# Altium schematic sheet PreAmplifier.SchDoc
size A
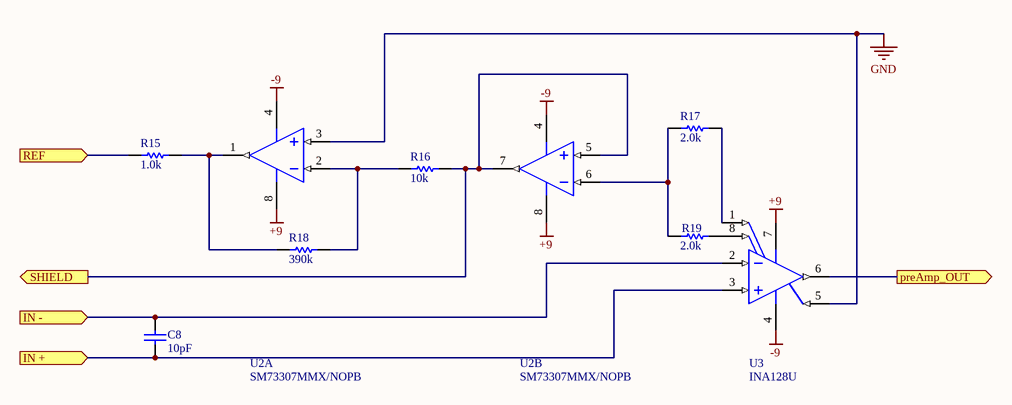
[diagram p0: PreAmplifier.SchDoc]

## Parts
C8  value 10pF  [0402cap]  (hidden comment: C0402)
R15  value 1.0k  [0402RES]  (hidden comment: R0402)
R16  value 10k  [0402RES]  (hidden comment: R0402)
R17  value 2.0k  [0402RES]  (hidden comment: R0402)
R18  value 390k  [0402RES]  (hidden comment: R0402)
R19  value 2.0k  [0402RES]  (hidden comment: R0402)
U2  SM73307MMX/NOPB  [MUA08A_N]  (parts A,B of 2)
U3  INA128U  [TI-D8_N]

## Ports
IN + (in), IN - (in), preAmp_OUT (out), REF (in), SHIELD (out)

## Nets
+9: U2.8(V+) U3.7(V+)
-9: U2.4(V-) U3.4(V-)
GND: U2.3(INA+) U3.5(REF)
IN +: C8.1 U3.3(VIN+) ; port IN +
IN -: C8.2 U3.2(VIN-) ; port IN -
preAmp_OUT: U3.6(VO) ; port preAmp_OUT
REF: R15.1 ; port REF
SHIELD: R16.2 U2.5(INB+) U2.7(OUTB) ; port SHIELD
NetR15_2: R15.2 R18.1 U2.1(OUTA)
NetR16_1: R16.1 R18.2 U2.2(INA-)
NetR17_1: R17.1 R19.1 U2.6(INB-)
NetR17_2: R17.2 U3.1(RG)
NetR19_2: R19.2 U3.8(RG)

## Library data of the parts
C8 = C0402: 0402 Ceramic Chip Capacitor - Standard
R15-R19 = R0402: 0402 Chip Resistor - Standard; ComponentLink1URL: *
U2 = SM73307MMX/NOPB: Dual Precision, 17 MHz, Low Noise, CMOS Input Amplifier, 8-pin Mini SOIC, 3500 Reel; Manufacturer: National Semiconductor; PackageTopMarking: ZXTT*S307; PowerWise: N; CompType: Amplifiers; High-Reliability: Y; DatasheetVersion: Jun-2011; PackageVersion: revF, Apr-2008; PackageReference: MUA08A; PackageDescription: MINI SOIC, .118 x .118 x .034in, 8 Lead, .0256in Pitch; PartNumber: SM73307MMX/NOPB; RoHS: Y; PinCount: 8; Code_JEDEC: MO-187-AA; ComponentLink1Description: Manufacturer URL; ComponentLink1URL: http://www.national.com/; ComponentLink2Description: SM73307 Datasheet; ComponentLink2URL: http://www.national.com/ds/SM/SM73307.pdf; ComponentLink3Description: SM73307 Web Page; ComponentLink3URL: http://www.national.com/pf/SM/SM73307.html; ComponentLink4Description: MUA08A Package Page; ComponentLink4URL: http://www.national.com/packaging/folders/mua08a.html
U3 = INA128U: Precision, Low Power Instrumentation Amplifier, -40 to 85 degC, 8-pin SOIC (D8), Green (RoHS & no Sb/Br); Manufacturer: Texas Instruments; CMRR(Min)(dB): 120; Gain(V/V): 1 to 10000; Input Bias Current (+/-)(Max)(nA): 5; Input Offset (+/-)(Max)(uV): 50; Input Offset Drift (+/-)(Max)(uV/Degrees Celsius): 0.5; Noise at 1kHz(Typ)(nV/rt(Hz)): 8; Non-Linearity (+/-)(Max)(%): 0.002; Number of Channels: 1; Quiescent Current (+/-)(Typ)(mA): 0.7; SubFamily: Dual Supply; Vs(Max)(V): 36; Vs(Min)(V): 4.5; DatasheetVersion: SBOS051B; PackageVersion: 4040047-3/M, 06/2011; PackageReference: D8; PackageDescription: 8-Pin Plastic Small Outline, Body 4.9 x 3.9 mm, Pitch 1.27 mm; Supplier 1: Digi-Key; Supplier Part Number 1: INA128U-ND; Supplier 2: Farnell; Supplier Part Number 2: 1212413; Supplier 3: Newark; Supplier Part Number 3: 35C1729; Supplier 4: Mouser; Supplier Part Number 4: 595-INA128U; Eco-Plan: Green (RoHS & no Sb/Br); Mounting Technology: Surface Mount; Code_JEDEC: MS-012; PartNumber: INA128U; ComponentLink1Description: Manufacturer URL; ComponentLink1URL: http://www.ti.com/; ComponentLink2Description: Datasheet; ComponentLink2URL: http://www.ti.com/general/docs/lit/getliterature.tsp?genericPartNumber=INA128&fileType=pdf; ComponentLink3Description: Package Specification; ComponentLink3URL: http://www.ti.com/litv/pdf/msoi002j